# EAGLE design Arturo_Veras (EAGLE 6.5.0)
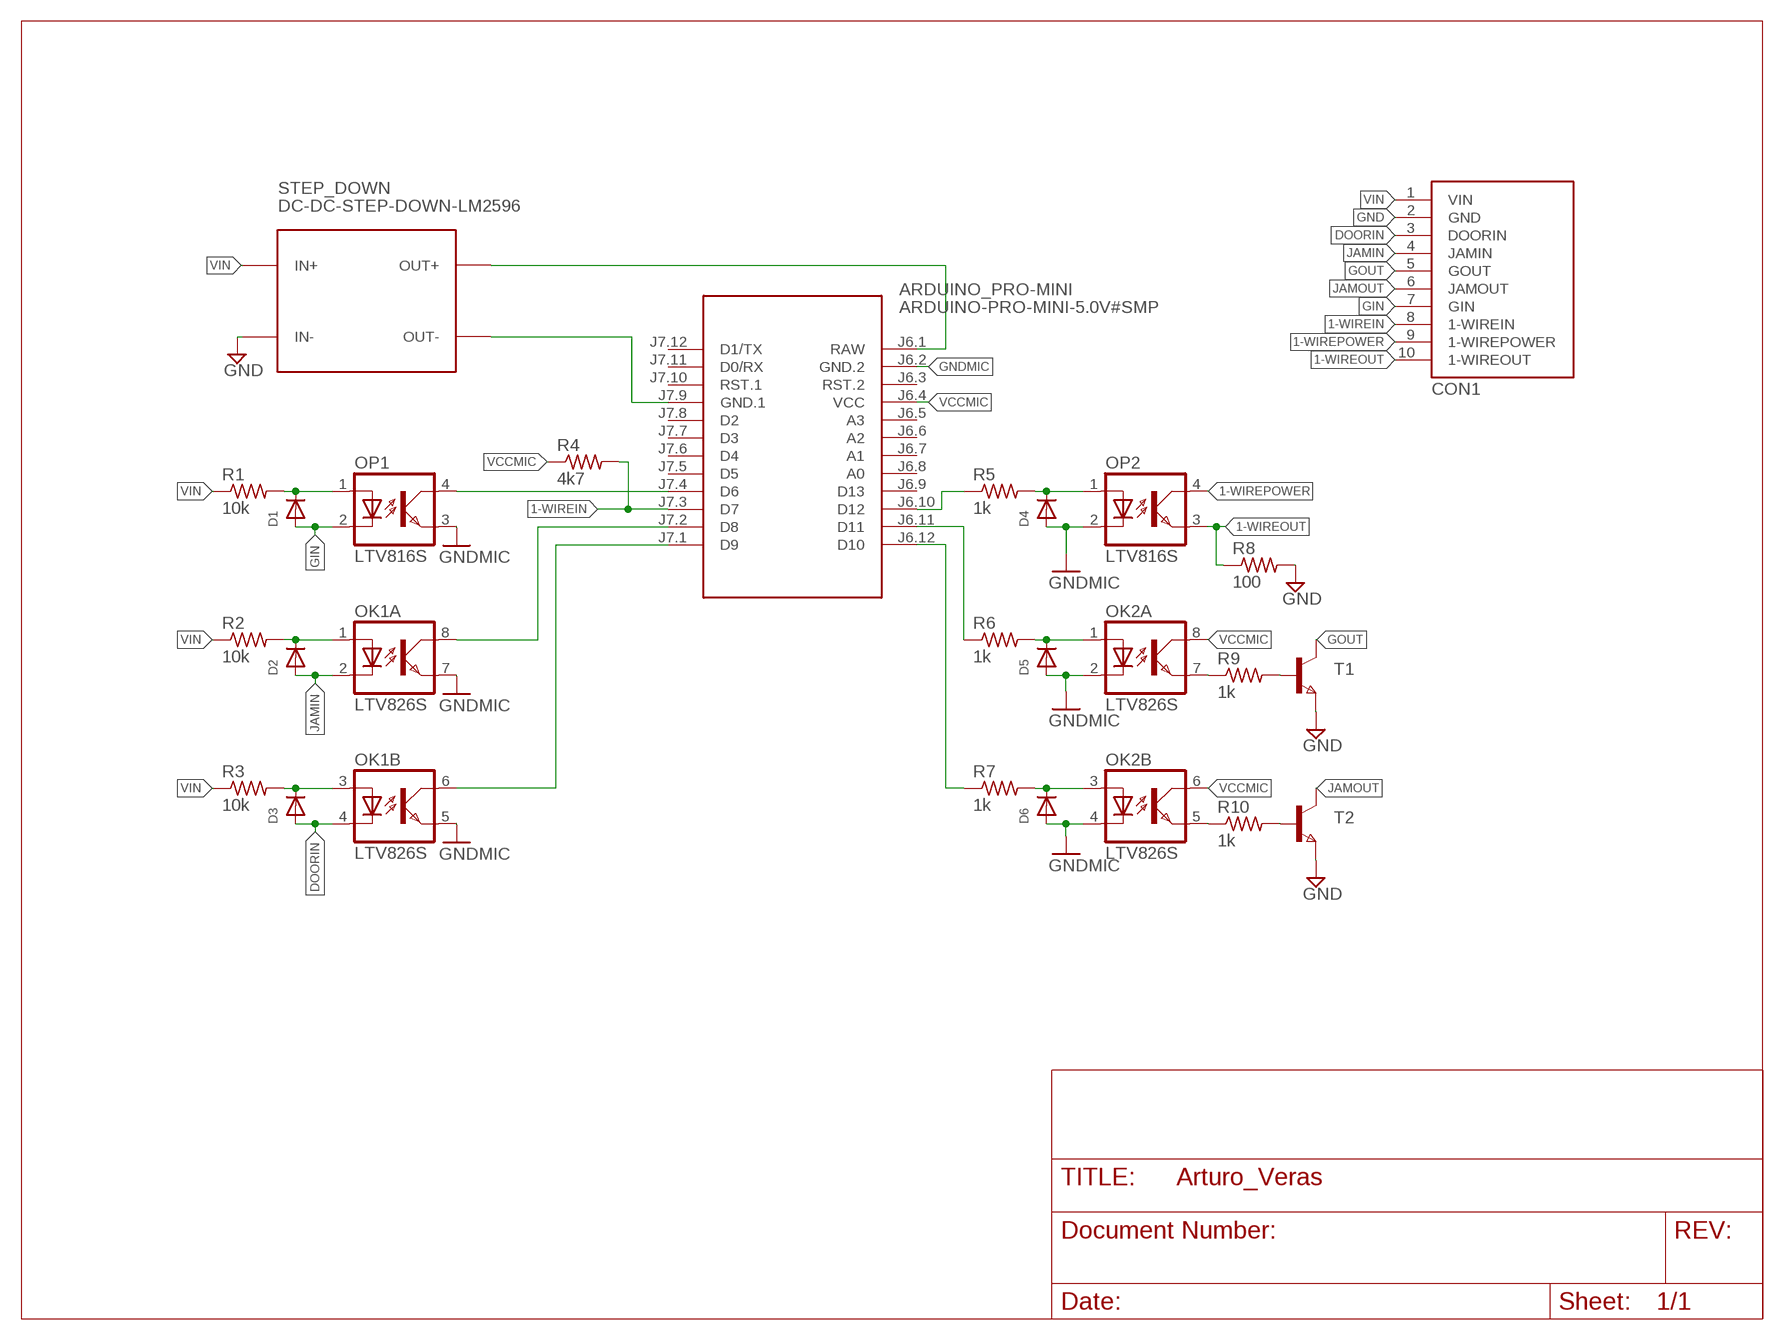
[diagram p0: schematic, sheet 1]

## Parts
ARDUINO_PRO-MINI  ARDUINO-PRO-MINI-5.0V#SMP  [ARDUINO-PRO-MINI#SMP]
CON1  TIN_HEADER_10POS  [MICRO_MATE_N_LOK_TRUEHOLE_10POS]
D1  DIODESOD-323F  [SOD-323F]
D2  DIODESOD-323F  [SOD-323F]
D3  DIODESOD-323F  [SOD-323F]
D4  DIODESOD-323F  [SOD-323F]
D5  DIODESOD-323F  [SOD-323F]
D6  DIODESOD-323F  [SOD-323F]
OK1  LTV826S  [DIL8-SMD]
OK2  LTV826S  [DIL8-SMD]
OP1  LTV816S  [SMD4]
OP2  LTV816S  [SMD4]
R1  10k  R-US_R0603  [R0603]
R2  10k  R-US_R0603  [R0603]
R3  10k  R-US_R0603  [R0603]
R4  4k7  R-US_R0603  [R0603]
R5  1k  R-US_R0603  [R0603]
R6  1k  R-US_R0603  [R0603]
R7  1k  R-US_R0603  [R0603]
R8  100  R-US_R0603  [R0603]
R9  1k  R-US_R0603  [R0603]
R10  1k  R-US_R0603  [R0603]
STEP_DOWN  DC-DC-STEP-DOWN-LM2596  [DC-DC-STEP-DOWN-LM2596]
T1  PBSS4360Z  [SOT223]
T2  PBSS4360Z  [SOT223]

## Nets
1-WIREIN: ARDUINO_PRO-MINI.J7.3(D7) CON1.8(1-WIREIN) R4.2
1-WIREOUT: CON1.10(1-WIREOUT) OP2.3(EMIT) R8.1
1-WIREPOWER: CON1.9(1-WIREPOWER) OP2.4(COL)
DOORIN: CON1.3(DOORIN) D3.A OK1.4(B:C)
GIN: CON1.7(GIN) D1.A OP1.2(C)
GND: CON1.2(GND) R8.2 STEP_DOWN.IN- T1.3(E) T2.3(E)
GNDMIC: ARDUINO_PRO-MINI.J6.2(GND.2) D4.A D5.A D6.A OK1.5(B:EMIT) OK1.7(A:EMIT) OK2.2(A:C) OK2.4(B:C) OP1.3(EMIT) OP2.2(C)
GOUT: CON1.5(GOUT) T1.2(C) T1.4(C)
JAMIN: CON1.4(JAMIN) D2.A OK1.2(A:C)
JAMOUT: CON1.6(JAMOUT) T2.2(C) T2.4(C)
N$1: ARDUINO_PRO-MINI.J7.9(GND.1) STEP_DOWN.OUT-
N$2: ARDUINO_PRO-MINI.J6.1(RAW) STEP_DOWN.OUT+
N$3: ARDUINO_PRO-MINI.J7.4(D6) OP1.4(COL)
N$4: D1.C OP1.1(A) R1.2
N$5: ARDUINO_PRO-MINI.J6.10(D12) R5.1
N$6: D2.C OK1.1(A:A) R2.2
N$7: ARDUINO_PRO-MINI.J7.2(D8) OK1.8(A:COL)
N$8: D3.C OK1.3(B:A) R3.2
N$9: D4.C OP2.1(A) R5.2
N$10: ARDUINO_PRO-MINI.J7.1(D9) OK1.6(B:COL)
N$11: OK2.7(A:EMIT) R9.1
N$12: ARDUINO_PRO-MINI.J6.11(D11) R6.1
N$13: D5.C OK2.1(A:A) R6.2
N$14: ARDUINO_PRO-MINI.J6.12(D10) R7.1
N$15: D6.C OK2.3(B:A) R7.2
N$16: OK2.5(B:EMIT) R10.1
N$17: R9.2 T1.1(B)
N$18: R10.2 T2.1(B)
VCCMIC: ARDUINO_PRO-MINI.J6.4(VCC) OK2.6(B:COL) OK2.8(A:COL) R4.1
VIN: CON1.1(VIN) R1.1 R2.1 R3.1 STEP_DOWN.IN+
Unconnected: ARDUINO_PRO-MINI.J6.3(RST.2) ARDUINO_PRO-MINI.J6.5(A3) ARDUINO_PRO-MINI.J6.6(A2) ARDUINO_PRO-MINI.J6.7(A1) ARDUINO_PRO-MINI.J6.8(A0) ARDUINO_PRO-MINI.J6.9(D13) ARDUINO_PRO-MINI.J7.5(D5) ARDUINO_PRO-MINI.J7.6(D4) ARDUINO_PRO-MINI.J7.7(D3) ARDUINO_PRO-MINI.J7.8(D2) ARDUINO_PRO-MINI.J7.10(RST.1) ARDUINO_PRO-MINI.J7.11(D0/RX) ARDUINO_PRO-MINI.J7.12(D1/TX)

## Library data of the parts
ARDUINO_PRO-MINI = diy-modules:ARDUINO-PRO-MINI-*#SMP: Arduino Pro Mini (and compatible devices) with 2 connectors only More details available here: https://www.arduino.cc/en/Main/ArduinoBoardProMini Click here to find device on ebay.com <http://www.ebay.com/sch/arduino+pro+mini>
CON1 = ArturoVeras:TIN_HEADER_10POS
D1-D6 = adafruit:DIODE: Diode SMADIODE - SMA Surface Mount Package 20V 1A Schottky Diode Digikey: 641-1014-6-ND DO-1N4148 - Through Hole Small Current Diode SOD-123 20V 1 A (.5mV Vf) Schottky Diode - Digikey: MBRX120TPMSCT-ND SOD-323 10V 570mA (.38mV Vf, 3ns) Schottky Diode - Digikey: ZLLS410CT-ND SOD-523 30V 30mA Schottky Diode (RB751S-40TE61) - Digikey: RB751S-40TE61CT-ND SOT23-R/W - SOT23 Package (R = Solder Paste/Reflow Ovens, W = Hand-Soldering) BAT54Film 40V 300mA - Digikey: 497-7162-1-ND
OK1 OK2 = optocoupler:LTV826: OPTO COUPLER Source: LITEON, LTV816.pdf; OC_FARNELL: unknown; OC_NEWARK: unknown
OP1 OP2 = ArturoVeras:LTV816S
R1-R10 = rcl:R-US_: RESISTOR, American symbol
STEP_DOWN = diy-modules:DC-DC-STEP-DOWN-LM2596: DC/DC Step-Down Regulator based on LM2596-ADJ chip LM2596 datasheet available here: http://www.ti.com/lit/ds/symlink/lm2596.pdf Click here to find device on ebay.com <http://www.ebay.com/sch/lm2596+power+regulator>
T1 T2 = ArturoVeras:PBSS4360Z

## Board
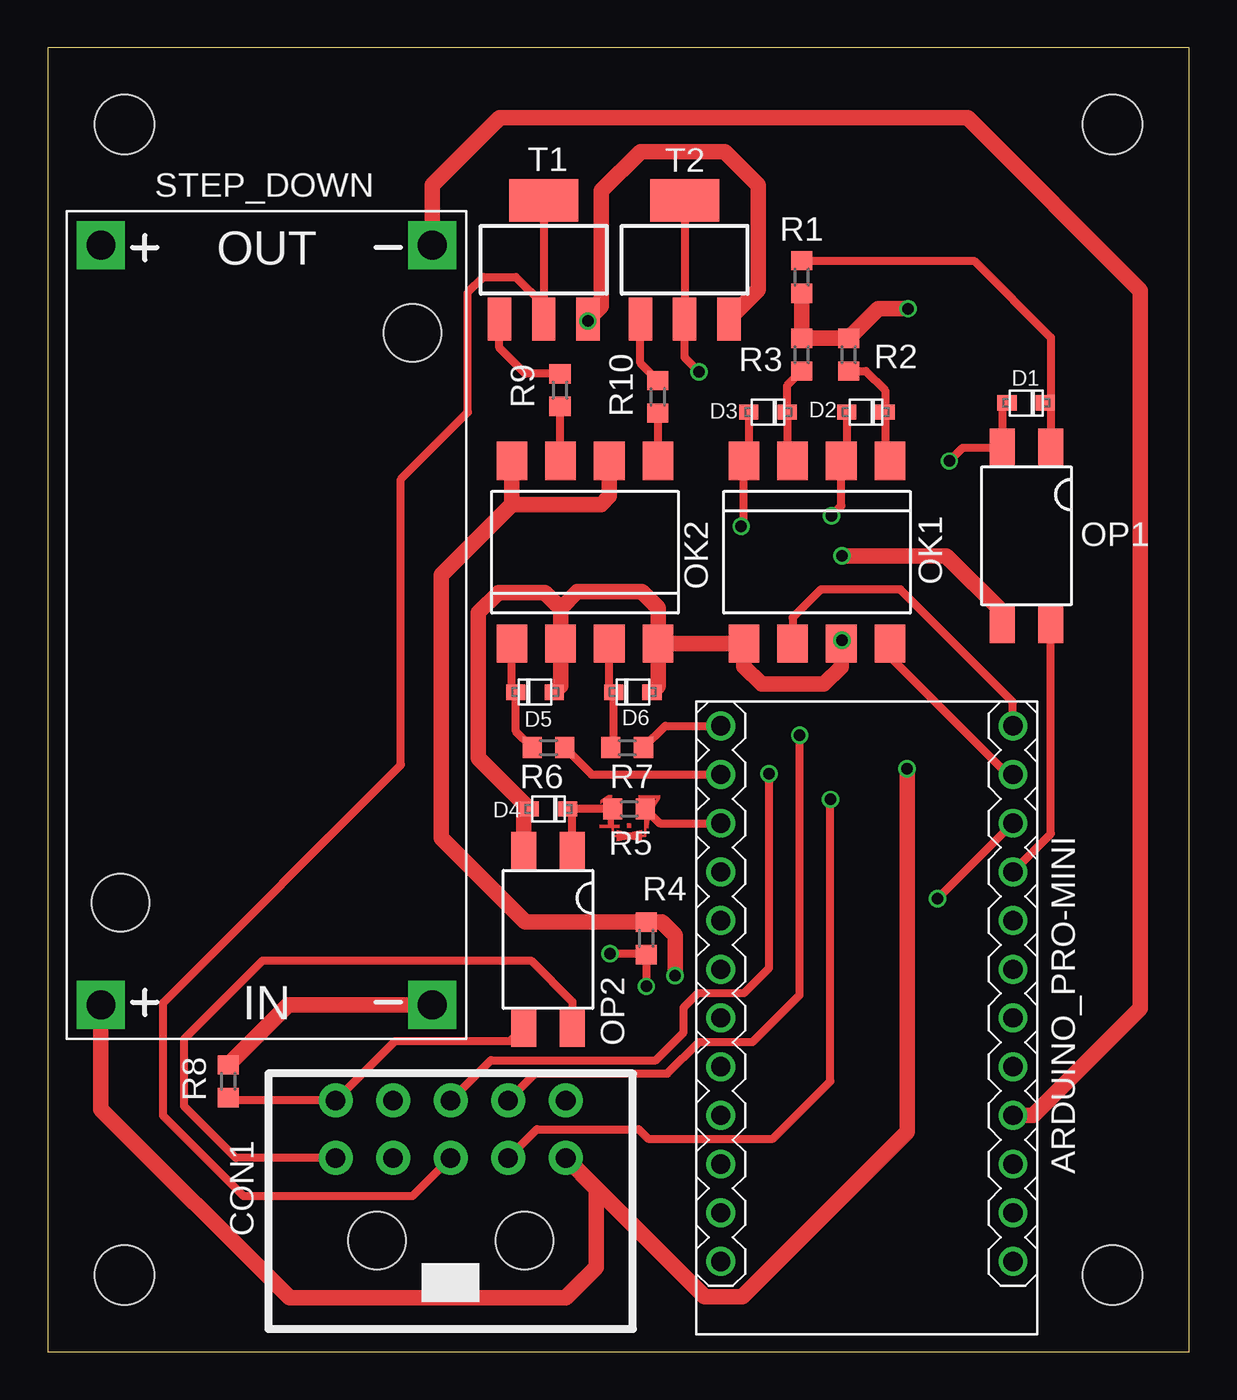
[diagram p1: board, top side]
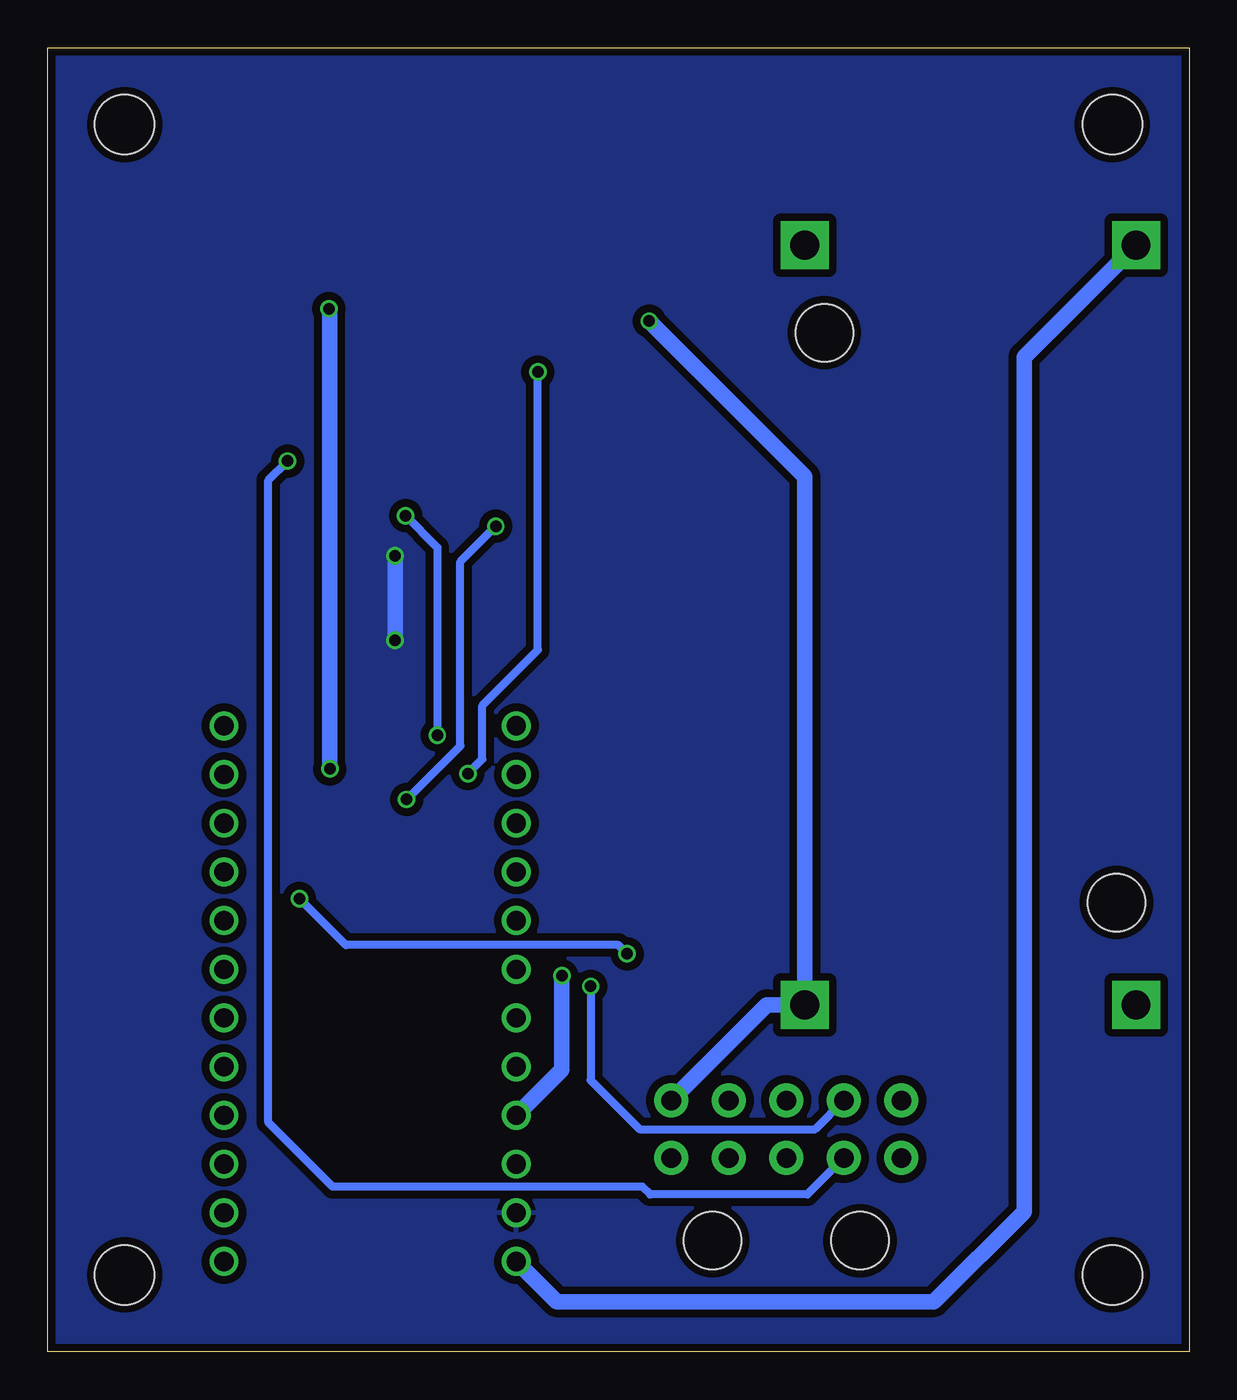
[diagram p2: board, bottom side, seen from below]

Size 59.5 x 68 mm. Coordinates in mm from the lower left corner, seen from the top.
Outline: 0,0 59.5,0 59.5,68 0,68 0,0
Copper layers (1*16): Top 0.035mm / dielectric 1.5mm / Bottom 0.035mm
Design rules "Reglas Eagle": minimum track width 6mil, minimum drill 12mil, track to track 6mil, track to pad 6mil, pad to pad 6mil, via to via 6mil, smd to smd 0mil, copper to edge 10mil, drill to drill 10mil, minimum pad ring 10mil, minimum via ring 6mil, stop-mask expansion 2mil, vias tented up to drill 100mil, thermal gap 10mil
Holes 3.1 mm at 4,4 4,64 55.5,4 55.5,64

### Footprints (pad centres in the part's own frame; a part is rotated, then mirrored left to right if it is on the bottom)
ARDUINO-PRO-MINI#SMP = drill 1: J6.1 -12.7,7.62; J6.2 -10.16,7.62; J6.3 -7.62,7.62; J6.4 -5.08,7.62; J6.5 -2.54,7.62; J6.6 0,7.62; J6.7 2.54,7.62; J6.8 5.08,7.62; J6.9 7.62,7.62; J6.10 10.16,7.62; J6.11 12.7,7.62; J6.12 15.24,7.62; J7.1 15.24,-7.62; J7.2 12.7,-7.62; J7.3 10.16,-7.62; J7.4 7.62,-7.62; J7.5 5.08,-7.62; J7.6 2.54,-7.62; J7.7 0,-7.62; J7.8 -2.54,-7.62; J7.9 -5.08,-7.62; J7.10 -7.62,-7.62; J7.11 -10.16,-7.62; J7.12 -12.7,-7.62
MICRO_MATE_N_LOK_TRUEHOLE_10POS = drill 1.02 pad 1.778: 1 6,2.5; 2 6,5.5; 3 3,2.5; 4 3,5.5; 5 0,2.5; 6 0,5.5; 7 -3,2.5; 8 -3,5.5; 9 -6,2.5; 10 -6,5.5 | hole 3: -3.84,-1.82; 3.84,-1.82
SOD-323F = smd 1 x 0.8: A -1,0; C 1,0
DIL8-SMD = smd 1.6 x 2: 1 -3.81,-4.77; 2 -1.27,-4.77; 3 1.27,-4.77; 4 3.81,-4.77; 5 3.81,4.77; 6 1.27,4.77; 7 -1.27,4.77; 8 -3.81,4.77
SMD4 = smd 1.3 x 2: 1 0.65,1; 2 3.2,1; 3 3.2,10.2; 4 0.65,10.2
R0603 = smd 1 x 1.1: 1 -0.85,0; 2 0.85,0
DC-DC-STEP-DOWN-LM2596 = drill 1.5 pad 2.5 square: IN+ -19.812,8.636; IN- -19.812,-8.636; OUT+ 19.812,8.636; OUT- 19.812,-8.636 | hole 3: -14.478,7.62; 15.24,-7.62
SOT223 = smd 1.219 x 2.235: 1 -2.311,-3.099; 2 0,-3.099; 3 2.311,-3.099 | smd 3.6 x 2.2: 4 0,3.099

### Placement (x,y rotation side)
ARDUINO_PRO-MINI  42.7,17.4 90 top
CON1  21,7.6 0 top
D1  51.01,49.48 0 top
D2  42.65,49 0 top
D3  37.55,49 0 top
D4  26.1,28.3 0 top
D5  25.4,34.4 180 top
D6  30.5,34.4 180 top
OK1  40.1,41.7 180 top
OK2  28,41.7 0 top
OP1  52.95,48.15 180 top
OP2  28,27.1 180 top
R1  39.3,56.05 90 top
R2  41.75,52 270 top
R3  39.3,52 270 top
R4  31.2,21.55 270 top
R5  30.3,28.3 180 top
R6  26.1,31.5 180 top
R7  30.2,31.5 180 top
R8  9.4,14.1 90 top
R9  26.7,50.15 90 top
R10  31.8,49.8 90 top
STEP_DOWN  11.4,37.9 90 top
T1  25.85,56.95 0 top
T2  33.2,56.95 0 top

### Tracks (layer width: path | path; a pad name or v marks a point on that pad's centre or on a via)
1-WIREIN  (via drill 0.6)
  Top 0.406: v31.2,19.05 R4.2 31.25,20.75 | 31.25,20.75 31.3,20.75 | 31.25,20.75 v29.3,20.75 | v46.39,23.63 ARDUINO_PRO-MINI.J7.3
  Bottom 0.406: CON1.8 19.5,11.6 28.65,11.6 31.2,14.15 v31.2,19.05 | v29.3,20.75 29.75,21.2 43.96,21.2 v46.39,23.63
1-WIREOUT
  Top 0.406: R8.1 9.55,13.1 CON1.10 18.1,16.2 24.1,16.2 OP2.3
1-WIREPOWER
  Top 0.406: CON1.9 9.8,10.1 7.1,12.8 7.1,16.3 11.2,20.4 25.2,20.4 27.35,18.25 OP2.4
DOORIN  (via drill 0.6)
  Top 0.406: CON1.3 25.5,11.6 30.8,11.6 31.3,11.1 37.8,11.1 40.8,14.1 v40.8,28.8 | D3.A 36.55,46.73 OK1.4 36.29,43.19 v36.15,43.05
  Bottom 0.406: v36.15,43.05 38,41.2 38,31.6 v40.8,28.8
GIN  (via drill 0.6)
  Top 0.406: D1.A 49.75,49.22 OP1.2 47.7,47.15 v47,46.45
  Bottom 0.406: CON1.7 19.9,8.2 28.1,8.2 28.5,8.6 44.65,8.6 48,11.95 48,45.45 v47,46.45
GND  (via drill 0.6)
  Top 0.813: STEP_DOWN.IN- 12.54,18.09 R8.2 | v28.15,53.75 28.16,53.76 T1.3 28.85,54.54 28.85,60.55 30.9,62.6 35.3,62.6 37.05,60.85 37.05,55.39 T2.3
  Bottom 0.813: CON1.2 22.01,18.09 STEP_DOWN.IN- 20.04,45.64 v28.15,53.75
GNDMIC  (via drill 0.6)
  Top 0.406: OK1.7 41.37,37.07 v41.4,37.1
  Top 0.813: 26.73,38.77 25.9,39.6 23.5,39.6 22.45,38.55 22.45,30.95 D4.A 24.8,28 OP2.2 | 26.73,38.77 OK2.2 26.73,34.73 D5.A | OK2.4 31.81,38.79 30.95,39.65 27.61,39.65 26.73,38.77 | OK2.4 OK1.5 36.29,35.74 37.22,34.81 40.46,34.81 41.37,35.72 OK1.7 | D6.A 31.81,34.71 OK2.4 | v41.4,41.5 46.85,41.5 49.75,38.6 OP1.3
  Bottom 0.813: v41.4,37.1 v41.4,41.5
  pour Bottom (isolate 0.406): 0,0 59.5,0 59.5,68 0,68
GOUT
  Top 0.406: CON1.5 19,8.1 10.2,8.1 6,12.3 6,18.2 18.4,30.6 18.4,45.5 21.9,49 21.9,55.25 22.7,56.05 24.4,56.05 25.85,54.6 | T1.4 25.85,54.6 | 25.85,54.6 T1.2
JAMIN  (via drill 0.6)
  Top 0.406: CON1.4 25.4,14.5 32.3,14.5 33.95,16.15 36.75,16.15 39.2,18.6 v39.2,32.15 | D2.A 41.65,46.75 OK1.2 41.37,44.12 v40.85,43.6
  Bottom 0.406: v40.85,43.6 39.2,41.95 v39.2,32.15
JAMOUT  (via drill 0.6)
  Top 0.406: CON1.6 23.1,15.2 31.7,15.2 33.15,16.65 33.15,17.95 33.9,18.7 36.3,18.7 37.6,20 v37.6,30.15 | T2.4 T2.2 33.2,51.85 v33.95,51.1
  Bottom 0.406: v33.95,51.1 33.95,36.6 36.85,33.7 36.85,30.9 v37.6,30.15
N$1
  Top 0.813: ARDUINO_PRO-MINI.J7.9 51.37,12.32 56.95,17.9 56.95,55.35 47.95,64.35 23.55,64.35 20.04,60.84 STEP_DOWN.OUT-
N$2
  Bottom 0.813: ARDUINO_PRO-MINI.J6.1 32.98,2.6 13.3,2.6 8.6,7.3 8.6,51.88 STEP_DOWN.OUT+
N$3
  Top 0.406: ARDUINO_PRO-MINI.J7.4 52.3,27 OP1.4
N$4
  Top 0.406: D1.C 52.3,49.19 | 52.3,49.19 52.3,49.05 OP1.1 | R1.2 48.3,56.9 52.3,52.9 52.3,49.19
N$5
  Top 0.406: R5.1 31.89,27.56 ARDUINO_PRO-MINI.J6.10
N$6
  Top 0.406: OK1.1 43.65,46.73 D2.C 43.65,50.15 42.65,51.15 R2.2
N$7
  Top 0.406: OK1.8 43.91,36.24 50.05,30.1 ARDUINO_PRO-MINI.J7.2
N$8
  Top 0.406: OK1.3 38.55,46.75 D3.C 38.55,50.4 R3.2
N$9
  Top 0.406: OP2.1 27.35,28.05 D4.C R5.2
N$10
  Top 0.406: ARDUINO_PRO-MINI.J7.1 50.32,33.88 44.45,39.75 40.3,39.75 38.83,38.28 OK1.6
N$11
  Top 0.406: R9.1 26.7,46.5 OK2.7
N$12
  Top 0.406: R6.1 28.35,30.1 ARDUINO_PRO-MINI.J6.11
N$13
  Top 0.406: OK2.1 24.19,34.61 D5.C 24.4,32.35 R6.2
N$14
  Top 0.406: R7.1 32.19,32.64 ARDUINO_PRO-MINI.J6.12
N$15
  Top 0.406: OK2.3 29.27,34.63 D6.C 29.5,31.65 R7.2
N$16
  Top 0.406: R10.1 OK2.5
N$17
  Top 0.406: R9.2 24.9,51 23.54,52.36 T1.1
N$18
  Top 0.406: R10.2 30.89,51.56 T2.1
VCCMIC  (via drill 0.6)
  Top 0.813: 24.19,44.19 20.5,40.5 20.5,26.8 24.9,22.4 R4.1 32,22.4 32.7,21.7 v32.7,19.6 | 24.19,44.19 OK2.8 | OK2.6 29.27,44.62 28.84,44.19 24.19,44.19
  Bottom 0.813: ARDUINO_PRO-MINI.J6.4 32.7,14.7 v32.7,19.6
VIN  (via drill 0.6)
  Top 0.813: STEP_DOWN.IN+ 2.76,12.64 12.6,2.8 27,2.8 28.6,4.4 28.6,8.5 CON1.1 34.25,2.85 36.2,2.85 44.8,11.45 v44.8,30.4 | v44.85,54.4 43.3,54.4 R2.1 R3.1 R1.1
  Bottom 0.813: v44.8,30.4 44.8,54.35 v44.85,54.4
(copper drawn outside any net)
  shapes: Top area x1